# Altium schematic sheet Sheet3_Fontes_Chaveadas_Fontes_Aux.SchDoc: Buck 24V 100W - Fontes Auxiliares
size A4; ApprovedBy: Prof. Me. Halisson Alves de Oliveira; CheckedBy: Manuel Batista Neto; Author: Artur Alves Torres de Araujo; DrawnBy: Artur Alves Torres de Araujo; Engineer: Artur Alves Torres de Araujo; Organization: UNIFOR - Universidade de Fortaleza; Address1: Av. Washington Soares, 1321; Address2: Edson Queiroz; Address3: CEP: 60811-905; Address4: Fortaleza - CE; DocumentNumber: 4; Revision: v1.0; SheetNumber: 4; SheetTotal: 4; Graduando:: Artur Alves Torres de Araujo; matAutor: 1610674; matRevisor: 1710872; DocumentName: Sheet3_Fontes_Chaveadas_Fontes_Aux.SchDoc
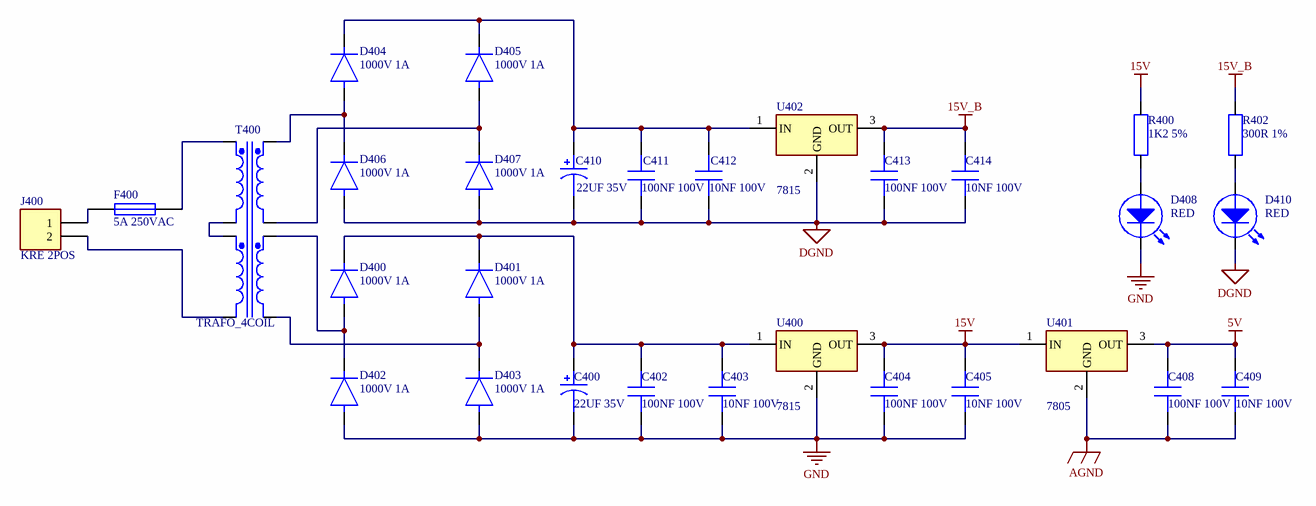
[diagram p0: Sheet3_Fontes_Chaveadas_Fontes_Aux.SchDoc]

## Parts
C400  22UF 35V  [CAP_RAD_D6MM3_L2MM5]
C402  100NF 100V  [CAP_RAD_4X2MM5]
C403  10NF 100V  [CAP_RAD_4X2MM5]
C404  100NF 100V  [CAP_RAD_4X2MM5]
C405  10NF 100V  [CAP_RAD_4X2MM5]
C408  100NF 100V  [CAP_RAD_4X2MM5]
C409  10NF 100V  [CAP_RAD_4X2MM5]
C410  22UF 35V  [CAP_RAD_D6MM3_L2MM5]
C411  100NF 100V  [CAP_RAD_4X2MM5]
C412  10NF 100V  [CAP_RAD_4X2MM5]
C413  100NF 100V  [CAP_RAD_4X2MM5]
C414  10NF 100V  [CAP_RAD_4X2MM5]
D400  1000V 1A  [DIO_PTH_DO41_1N4007]
D401  1000V 1A  [DIO_PTH_DO41_1N4007]
D402  1000V 1A  [DIO_PTH_DO41_1N4007]
D403  1000V 1A  [DIO_PTH_DO41_1N4007]
D404  1000V 1A  [DIO_PTH_DO41_1N4007]
D405  1000V 1A  [DIO_PTH_DO41_1N4007]
D406  1000V 1A  [DIO_PTH_DO41_1N4007]
D407  1000V 1A  [DIO_PTH_DO41_1N4007]
D408  RED  [DIO_PTH_LED_RED]
D410  RED  [DIO_PTH_LED_RED]
F400  5A 250VAC  [FUSE_PTH_5X20MM]
J400  KRE 2POS  [CONN_KF3012P]
R400  1K2 5%  [RES_PTH_AXIAL_250MW]
R402  300R 1%  [RES_PTH_AXIAL_250MW]
T400  TRAFO_4COIL  [TRF_8]
U400  7815  [PTH_TO220AB]
U401  7805  [PTH_TO220AB]
U402  7815  [PTH_TO220AB]

## Nets
5V: C408.1 C409.1 U401.3(OUT)
15V: C404.1 C405.1 R400.1 U400.3(OUT) U401.1(IN)
15V_B: C413.1 C414.1 R402.1 U402.3(OUT)
AGND: C408.2 C409.2 U401.2(GND)
DGND: C410.2(-) C411.2 C412.2 C413.2 C414.2 D406.2(A) D407.2(A) D410.2(K) U402.2(GND)
GND: C400.2(-) C402.2 C403.2 C404.2 C405.2 D402.2(A) D403.2(A) D408.2(K) U400.2(GND)
NetC400_1: C400.1(+) C402.1 C403.1 D400.1(K) D401.1(K) U400.1(IN)
NetC410_1: C410.1(+) C411.1 C412.1 D404.1(K) D405.1(K) U402.1(IN)
NetD400_2: D400.2(A) D402.1(K) T400.7(Sec2+)
NetD401_2: D401.2(A) D403.1(K) T400.8(Sec2-)
NetD404_2: D404.2(A) D406.1(K) T400.5(Sec1+)
NetD405_2: D405.2(A) D407.1(K) T400.6(Sec1-)
NetD408_1: D408.1(A) R400.2
NetD410_1: D410.1(A) R402.2
NetF400_1: F400.1 J400.1
NetF400_2: F400.2 T400.1(Pri+)
NetJ400_2: J400.2 T400.4(Pri2-)
NetT400_2: T400.2(Pri-) T400.3(Pri2+)

## Notes on the sheet
- Título:
- Tamanho:
- Revisor:
- Autor:
- A4
- Data:
- Versão:
- Mat:
- Curso:
- Bacharelado em Engenharia Eletrônica
- Aprovado por:
- Disciplina:
- Projeto de Fontes Chaveadas
- Folha:
- de

## Library data of the parts
C400 C410 = CAP_ALUM_22UF_35V_RAD: CAP ALUM POLY 22UF 20% 35V T/H; PartNumber: 870055673002; DkPart: 732-6368-1-ND; Manufacturer: Wurth-Elektronik; DkMOQ: 1; DkPrice: 0,93; BrPrice: 0; BrLink: https://www.autocorerobotica.com.br/capacitor-eletrolitico-22uf-50v; Datasheet: https://www.we-online.com/katalog/datasheet/870055673002.pdf
C402 C404 C408 C411 C413 = CAP_CER_100NF_100V_RAD: CAP CER 0.1UF 100V X7S RADIAL; PartNumber: FG18X7S2A104KRT06; DkPart: 445-173281-1-ND; Manufacturer: TDK Corporation; DkMOQ: 1; DkPrice: 0,38; BrPrice: 0; Datasheet: https://product.tdk.com/en/system/files?file=dam/doc/product/capacitor/ceramic/lead-mlcc/catalog/leadmlcc_halogenfree_fg_en.pdf
C403 C405 C409 C412 C414 = CAP_CER_10NF_100V_RAD: CAP CER 10NF 100V C0G/NP0 RADIAL; PartNumber: FA18C0G2A103JRU06; DkPart: 445-175393-1-ND; Manufacturer: TDK Corporation; DkMOQ: 1; DkPrice: 0,44; BrPrice: 0; Datasheet: https://product.tdk.com/en/system/files?file=dam/doc/product/capacitor/ceramic/lead-mlcc/catalog/leadmlcc_halogenfree_fa_en.pdf
D400-D407 = DIO_PTH_STD_1000V_1A_1N4007: DIODE GEN PURP 1KV 1A DO41; PartNumber: 1N4007-TP; DkPart: 1N4007-TPMSCT-ND; Manufacturer: Micro Commercial Co; DkMOQ: 1; DkPrice: 0,22; BrPrice: 0; Datasheet: https://www.mccsemi.com/pdf/Products/1N4001~1N4007(DO-41).pdf
D408 D410 = DIO_PTH_LED_RED_5MM: LED RED DIFFUSED T-1 3/4 T/H; PartNumber: XLUR12D; DkPart: 1497-1031-ND; Manufacturer: SunLED; DkMOQ: 1; DkPrice: 0,29; BrPrice: 0; Datasheet: https://www.sunledusa.com/products/spec/XLUR12D.pdf
F400 = FUSE_PTH_5A_250VAC: FUSE GLASS 5A 250VAC 5X20MM; PartNumber: 5STP 5-R; DkPart: 507-1561-ND; Manufacturer: Bel Fuse Inc.; DkMOQ: 1; DkPrice: 0,76; BrPrice: 0; Datasheet: https://www.belfuse.com/resources/datasheets/circuitprotection/ds-cp-5st-5stp-series.pdf
J400 = CONN_2POS: TERM BLK 2POS SIDE ENTRY 5MM PCB; PartNumber: 1776244-2; DkPart: A97996-ND; Manufacturer: TE Connectivity AMP Connectors; DkMOQ: 1; DkPrice: 1,1; BrPrice: 0; Datasheet: https://www.te.com/commerce/DocumentDelivery/DDEController?Action=srchrtrv&DocNm=1308389_EUROSTYLE_TERMINAL_BLOCKS&DocType=CS&DocLang=English
R400 = RES_1K2_5%_250MW_AXIAL: RES 1.2K OHM 5% 1/4W AXIAL; PartNumber: CFR-25JB-52-1K2; DkPart: 1.2KQBK-ND; Manufacturer: YAGEO; DkMOQ: 1; DkPrice: 0,1; BrPrice: 0; Datasheet: https://www.yageo.com/upload/media/product/productsearch/datasheet/lr/YAGEO%20CFR_datasheet_2021v0.pdf
R402 = RES_300R_1%_250MW_AXIAL: RES 300 OHM 1% 1/4W AXIAL; PartNumber: RNMF14FTC300R; DkPart: S300CACT-ND; Manufacturer: Stackpole Electronics Inc; DkMOQ: 1; DkPrice: 0,1; BrPrice: 0; Datasheet: https://www.seielect.com/catalog/sei-rnf_rnmf.pdf
T400 = TRANSFORMER_4WINDING: TRANSFORMER 4 COILS; PartNumber: _TRAFO_02; Manufacturer: UNIFOR; DkPrice: 0; Datasheet: N/A; DkMOQ: N/A; DkPart: N/A; BrPrice: 0
U400 U402 = IC_LM7815: IC REG LINEAR 15V 1.5A TO220AB; DkPart: 497-1454-5-ND; Manufacturer: STMicroelectronics; PartNumber: L7815CV; DkMOQ: 1; DkPrice: 0,69; BrPrice: 0; Datasheet: https://www.st.com/content/ccc/resource/technical/document/datasheet/41/4f/b3/b0/12/d4/47/88/CD00000444.pdf/files/CD00000444.pdf/jcr:content/translations/en.CD00000444.pdf
U401 = IC_LM7805: IC REG LINEAR 5V 1.5A TO220AB; DkPart: 497-1443-5-ND; Manufacturer: STMicroelectronics; PartNumber: L7805CV; DkMOQ: 1; DkPrice: 0,69; BrPrice: 0; Datasheet: https://www.st.com/content/ccc/resource/technical/document/datasheet/41/4f/b3/b0/12/d4/47/88/CD00000444.pdf/files/CD00000444.pdf/jcr:content/translations/en.CD00000444.pdf